# EAGLE schematic audio_con (EAGLE 7.2.0)
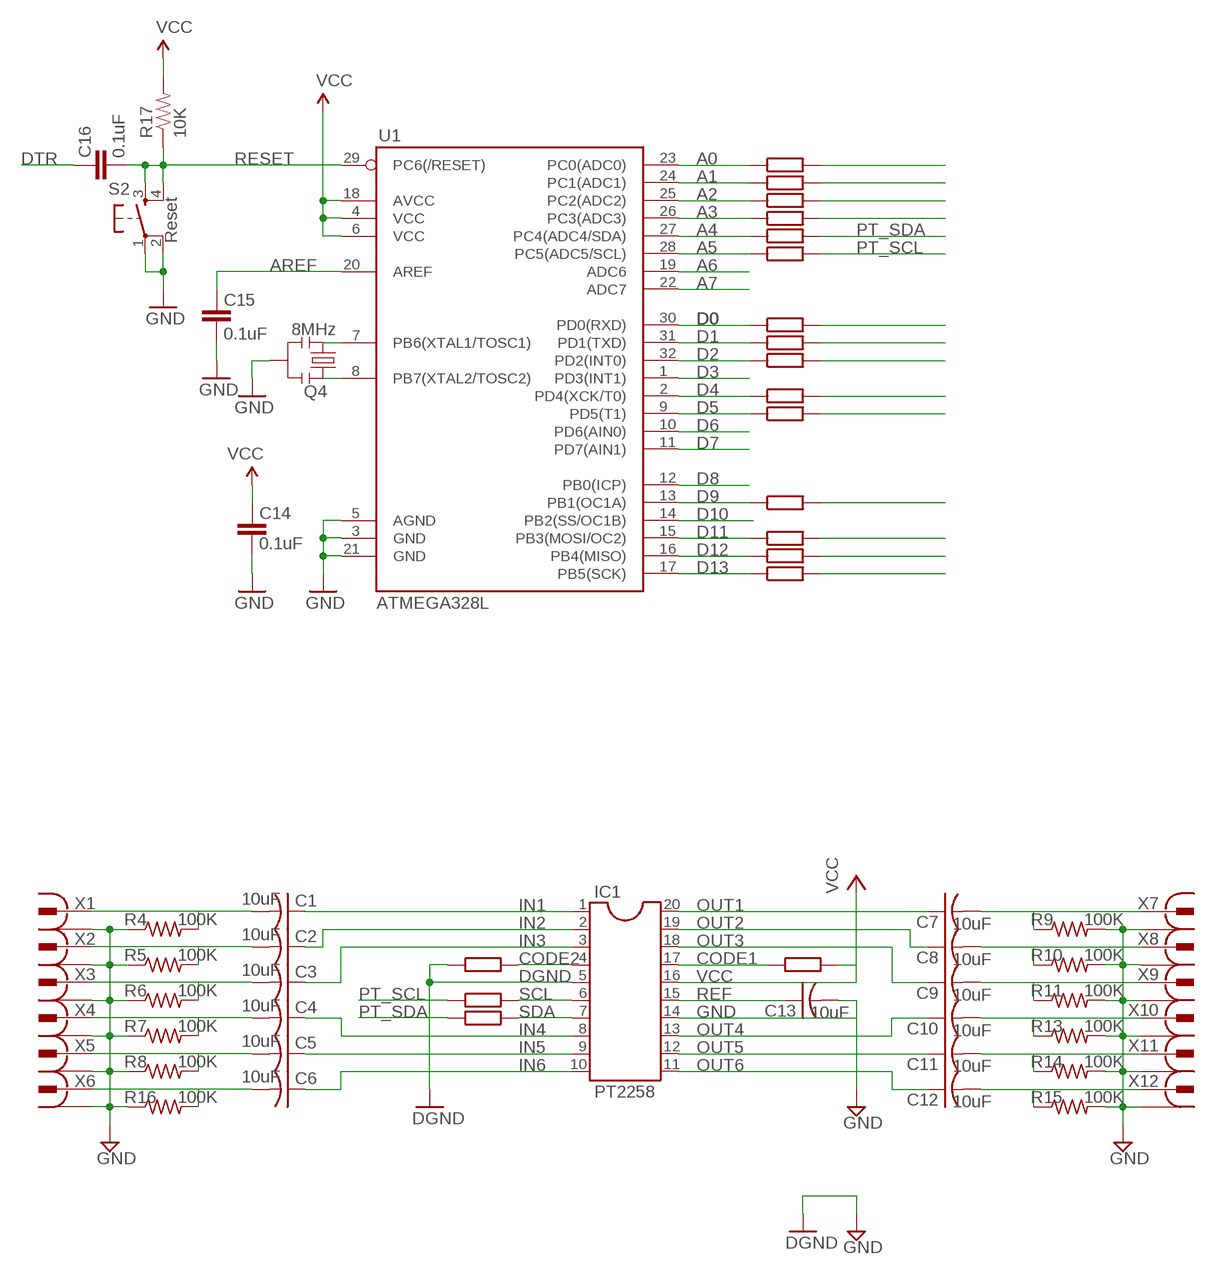
[diagram p0: schematic, sheet 1]

## Parts
C1  10uF  C-USC0603  [C0603]
C2  10uF  C-USC0603  [C0603]
C3  10uF  C-USC0603  [C0603]
C4  10uF  C-USC0603  [C0603]
C5  10uF  C-USC0603  [C0603]
C6  10uF  C-USC0603  [C0603]
C7  10uF  C-USC0603  [C0603]
C8  10uF  C-USC0603  [C0603]
C9  10uF  C-USC0603  [C0603]
C10  10uF  C-USC0603  [C0603]
C11  10uF  C-USC0603  [C0603]
C12  10uF  C-USC0603  [C0603]
C13  10uF  C-USC0603  [C0603]
C14  0.1uF  CAP0402  [C0402]
C15  0.1uF  CAP0402  [C0402]
C16  0.1uF  CAP0402  [C0402]
IC1  PT2258  DIL20  [DIL20]
Q4  8MHz  RESONATORSMD  [RESONATOR-SMD]
R4  100K  R-US_0613/5V  [P0613V]
R5  100K  R-US_0613/5V  [P0613V]
R6  100K  R-US_0613/5V  [P0613V]
R7  100K  R-US_0613/5V  [P0613V]
R8  100K  R-US_0613/5V  [P0613V]
R9  100K  R-US_0613/5V  [P0613V]
R10  100K  R-US_0613/5V  [P0613V]
R11  100K  R-US_0613/5V  [P0613V]
R13  100K  R-US_0613/5V  [P0613V]
R14  100K  R-US_0613/5V  [P0613V]
R15  100K  R-US_0613/5V  [P0613V]
R16  100K  R-US_0613/5V  [P0613V]
R17  10K  RESISTOR0402  [C0402]
S2  Reset  TAC_SWITCHSND  [TACTILE_SWITCH_SMD]
U1  ATMEGA328L  ATMEGA168  [TQFP32-08]
X1  736880-49  [736880-49]
X2  736880-49  [736880-49]
X3  736880-49  [736880-49]
X4  736880-49  [736880-49]
X5  736880-49  [736880-49]
X6  736880-49  [736880-49]
X7  736880-49  [736880-49]
X8  736880-49  [736880-49]
X9  736880-49  [736880-49]
X10  736880-49  [736880-49]
X11  736880-49  [736880-49]
X12  736880-49  [736880-49]

## Nets
A0: U1.23(PC0(ADC0))
A1: U1.24(PC1(ADC1))
A2: U1.25(PC2(ADC2))
A3: U1.26(PC3(ADC3))
A4: U1.27(PC4(ADC4/SDA))
A5: U1.28(PC5(ADC5/SCL))
A6: U1.19(ADC6)
A7: U1.22(ADC7)
AREF: C15.2 U1.20(AREF)
CODE1: IC1.17
CODE2: IC1.4
D0: U1.30(PD0(RXD))
D1: U1.31(PD1(TXD))
D2: U1.32(PD2(INT0))
D3: U1.1(PD3(INT1))
D4: U1.2(PD4(XCK/T0))
D5: U1.9(PD5(T1))
D6: U1.10(PD6(AIN0))
D7: U1.11(PD7(AIN1))
D8: U1.12(PB0(ICP))
D9: U1.13(PB1(OC1A))
D10: U1.14(PB2(SS/OC1B))
D11: U1.15(PB3(MOSI/OC2))
D12: U1.16(PB4(MISO))
D13: U1.17(PB5(SCK))
DGND: IC1.5
DTR: C16.2
GND: C13.2 C14.1 C15.1 IC1.14 Q4.2 R4.1 R5.1 R6.1 R7.1 R8.1 R9.2 R10.2 R11.2 R13.2 R14.2 R15.2 R16.1 S2.1 S2.2 U1.3(GND) U1.5(AGND) U1.21(GND) X1.1 X1.1@1 X1.1@2 X2.1 X2.1@1 X2.1@2 X3.1 X3.1@1 X3.1@2 X4.1 X4.1@1 X4.1@2 X5.1 X5.1@1 X5.1@2 X6.1 X6.1@1 X6.1@2 X7.1 X7.1@1 X7.1@2 X8.1 X8.1@1 X8.1@2 X9.1 X9.1@1 X9.1@2 X10.1 X10.1@1 X10.1@2 X11.1 X11.1@1 X11.1@2 X12.1 X12.1@1 X12.1@2 ; supply symbol labelled DGND
IN1: C1.1 IC1.1
IN2: C2.1 IC1.2
IN3: C3.1 IC1.3
IN4: C4.1 IC1.8
IN5: C5.1 IC1.9
IN6: C6.1 IC1.10
N$1: C7.2 R9.1 X7.2
N$4: C8.2 R10.1 X8.2
N$5: C1.2 R4.2 X1.2
N$6: C2.2 R5.2 X2.2
N$7: C3.2 R6.2 X3.2
N$8: C4.2 R7.2 X4.2
N$9: C5.2 R8.2 X5.2
N$10: C6.2 R16.2 X6.2
N$11: C9.2 R11.1 X9.2
N$12: C10.2 R13.1 X10.2
N$13: C11.2 R14.1 X11.2
N$14: C12.2 R15.1 X12.2
N$15: Q4.1 U1.8(PB7(XTAL2/TOSC2))
N$16: Q4.3 U1.7(PB6(XTAL1/TOSC1))
OUT1: C7.1 IC1.20
OUT2: C8.1 IC1.19
OUT3: C9.1 IC1.18
OUT4: C10.1 IC1.13
OUT5: C11.1 IC1.12
OUT6: C12.1 IC1.11
REF: C13.1 IC1.15
RESET: C16.1 R17.1 S2.3 S2.4 U1.29(PC6(/RESET))
SCL: IC1.6
SDA: IC1.7
VCC: C14.2 IC1.16 R17.2 U1.4(VCC) U1.6(VCC) U1.18(AVCC)

## Library data of the parts
C1-C13 = adafruit:C-US: CAPACITOR, American symbol
C14-C16 = SparkFun:CAP: Capacitor Standard 0603 ceramic capacitor, and 0.1" leaded capacitor.
IC1 = ic-package:DIL20: Dual In Line / Socket
Q4 = SparkFun:RESONATOR: Resonator Small SMD resonator. This is the itty bitty 10/20MHz resonators with built in caps. CSTCE10M0G55 and CSTCE20M0V53. Footprint has been reviewed closely but hasn't been tested yet.
R4-R11 R13-R16 = adafruit:R-US_: RESISTOR, American symbol
R17 = SparkFun:RESISTOR: Resistor Basic schematic elements and footprints for 0603, 1206, and PTH 1/10th watt (small) resistors.
S2 = SparkFun:TAC_SWITCH: Momentary Switch Button commonly used for reset or general input. Spark Fun Electronics SKU : COM-00097
U1 = SparkFun:ATMEGA168
X1-X12 = con-conrad:736880-49: Cinch Connector ( RCA Jack ) Cinch-Einbaukupplung 90º 72345 Vernickelt BKL Electronic Source: Conrad <http://www.conrad.de/ce/de/product/736880>